# EAGLE design LM3S5749 (EAGLE 6.3)

## Sheet 1 of 2: LM3S5749
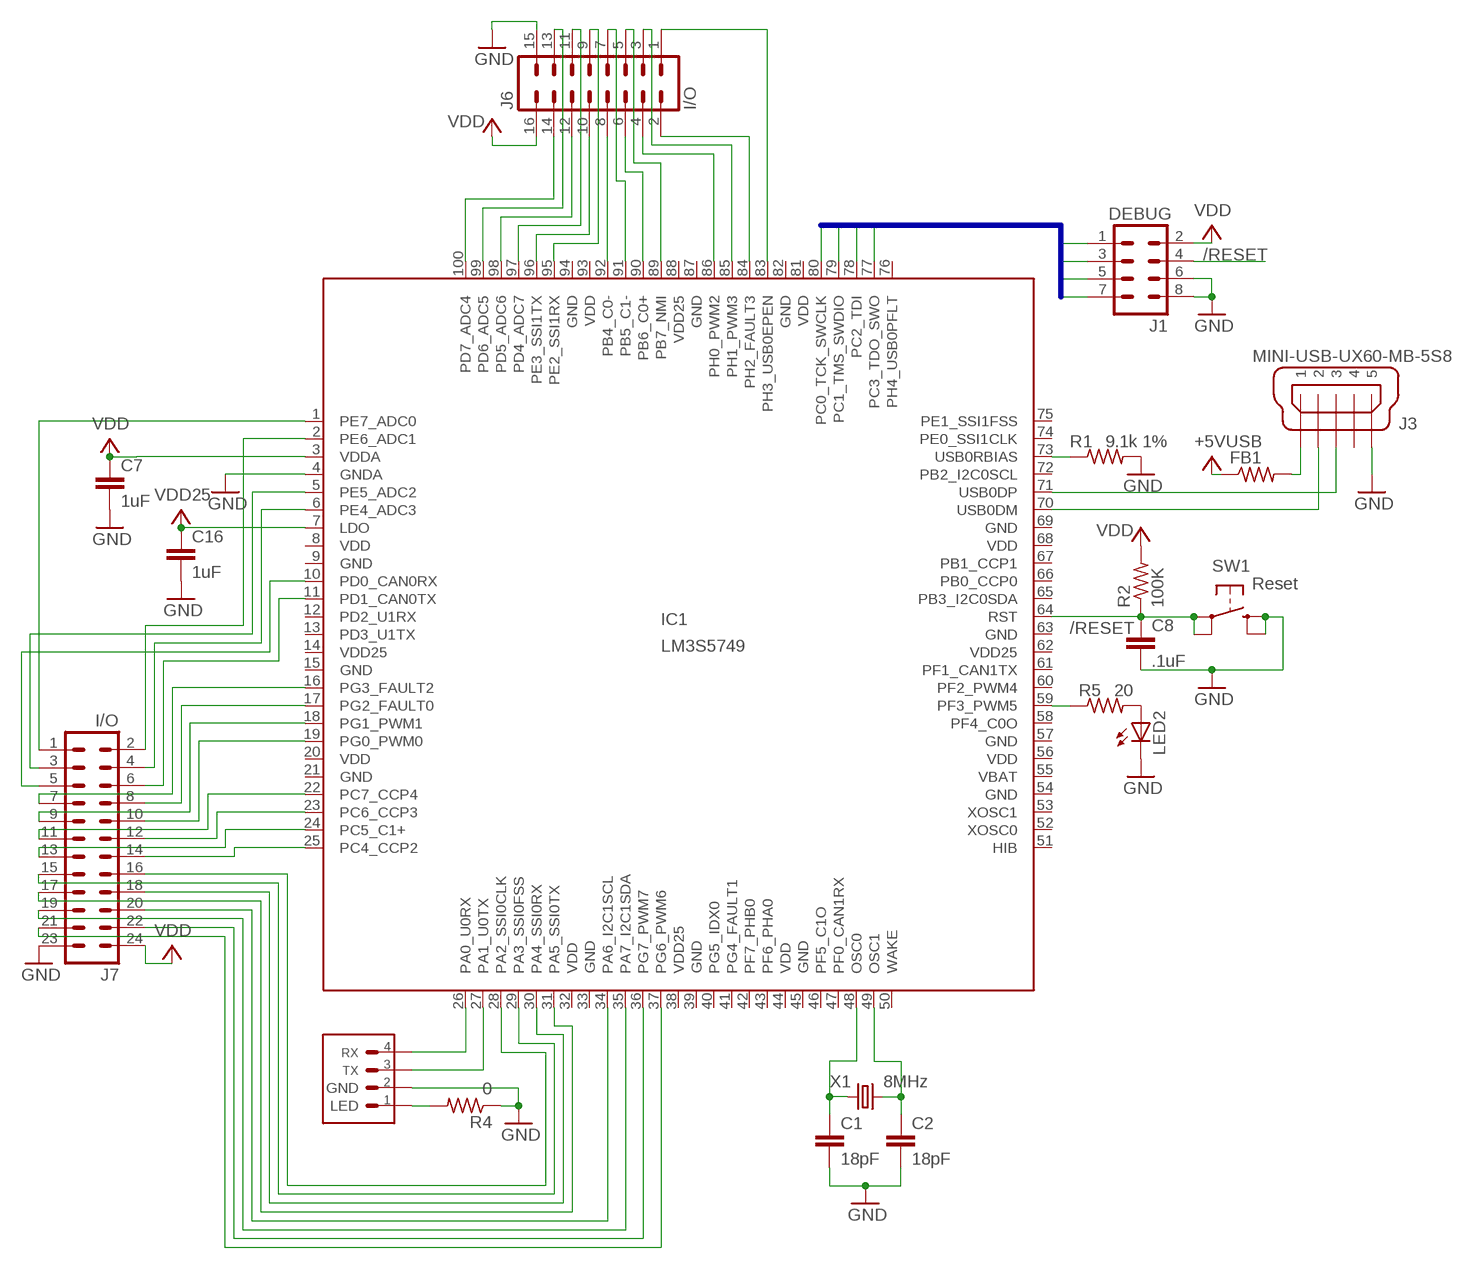
[diagram p0: schematic, sheet 1]

### Parts
C1  18pF  C-EUC0603  [C0603]
C2  18pF  C-EUC0603  [C0603]
C7  1uF  C-EUC0603  [C0603]
C8  .1uF  C-EUC0603  [C0603]
C16  1uF  C-EUC0603  [C0603]
FB1  0  R-US_R0805  [R0805]
IC1  LM3S5749  [LQFP-100]
J1  DEBUG  HEADER_4X2  [HEADER_.100IN_8PIN_4X2]
J3  MINI-USB-UX60-MB-5S8  [UX60-MB-5S8]
J4  Serial  FLEX_SERIAL_HEADER  [4-PIN_1.25MM]
J6  I/O  HEADER_8X2  [HEADER_.100IN_16PIN_8X2]
J7  I/O  HEADER_24PIN_D  [HEADER_.100IN_24PIN_D]
LED2  LEDCHIPLED_0603  [CHIPLED_0603]
R1  9.1k 1%  R-US_R0603  [R0603]
R2  100K  R-US_R0603  [R0603]
R4  0  R-US_R0603  [R0603]
R5  20  R-US_R0603  [R0603]
SW1  Reset  SMT_PUSHBUTTON  [SMT_PUSHBUTTON]
X1  8MHz  XTAL_2SMD_8MMX4.5MM  [2-SMD_8MMX4.5MM]

### Nets
/RESET: C8.1 IC1.64(RST) J1.4 R2.1 SW1.P$1(P1) SW1.P$2(P)
GND: C1.2 C2.2 C7.2 C8.2 C16.2 IC1.4(GNDA) J1.6 J1.8 J3.5 J4.2(S2) J6.15 J7.23 LED2.C R1.2 R4.1 SW1.P$3(S1) SW1.P$4(S) ; also sheet 2
N$1: IC1.73(USB0RBIAS) R1.1
N$2: C1.1 IC1.48(OSC0) X1.1
N$3: C2.1 IC1.49(OSC1) X1.2
N$5: IC1.26(PA0_U0RX) J4.4(S4)
N$6: IC1.27(PA1_U0TX) J4.3(S3)
N$7: FB1.2 J3.1
N$8: FB1.1 ; supply symbol labelled +5VUSB ; also sheet 2
N$9: IC1.16(PG3_FAULT2) J7.7
N$10: IC1.17(PG2_FAULT0) J7.8
N$11: IC1.18(PG1_PWM1) J7.9
N$12: IC1.19(PG0_PWM0) J7.10
N$13: IC1.36(PG7_PWM7) J7.22
N$14: IC1.37(PG6_PWM6) J7.21
N$15: LED2.A R5.2
N$16: IC1.59(PF3_PWM5) R5.1
N$17: IC1.71(USB0DP) J3.3
N$18: IC1.70(USB0DM) J3.2
N$19: IC1.28(PA2_SSI0CLK) J7.16
N$20: IC1.29(PA3_SSI0FSS) J7.15
N$21: IC1.30(PA4_SSI0RX) J7.18
N$22: IC1.31(PA5_SSI0TX) J7.17
N$23: IC1.34(PA6_I2C1SCL) J7.20
N$24: IC1.35(PA7_I2C1SDA) J7.19
N$25: J4.1(S1) R4.2
N$26: IC1.22(PC7_CCP4) J7.11
N$27: IC1.23(PC6_CCP3) J7.12
N$28: IC1.24(PC5_C1+) J7.13
N$29: IC1.25(PC4_CCP2) J7.14
N$30: IC1.83(PH3_USB0EPEN) J6.1
N$31: IC1.84(PH2_FAULT3) J6.2
N$32: IC1.85(PH1_PWM3) J6.3
N$33: IC1.86(PH0_PWM2) J6.4
N$34: IC1.89(PB7_NMI) J6.5
N$35: IC1.90(PB6_C0+) J6.6
N$36: IC1.91(PB5_C1-) J6.7
N$37: IC1.92(PB4_C0-) J6.8
N$38: IC1.95(PE2_SSI1RX) J6.9
N$39: IC1.96(PE3_SSI1TX) J6.10
N$40: IC1.97(PD4_ADC7) J6.11
N$41: IC1.98(PD5_ADC6) J6.12
N$42: IC1.99(PD6_ADC5) J6.13
N$43: IC1.100(PD7_ADC4) J6.14
N$44: IC1.1(PE7_ADC0) J7.1
N$45: IC1.2(PE6_ADC1) J7.2
N$46: IC1.5(PE5_ADC2) J7.3
N$47: IC1.6(PE4_ADC3) J7.4
N$48: IC1.10(PD0_CAN0RX) J7.5
N$49: IC1.11(PD1_CAN0TX) J7.6
TCK: IC1.80(PC0_TCK_SWCLK) J1.1
TDI: IC1.78(PC2_TDI) J1.5
TDO: IC1.77(PC3_TDO_SWO) J1.7
TMS: IC1.79(PC1_TMS_SWDIO) J1.3
VDD: C7.1 IC1.3(VDDA) J1.2 J6.16 J7.24 R2.2 ; also sheet 2
VDD25: C16.1 IC1.7(LDO) ; also sheet 2
Unconnected: IC1.12(PD2_U1RX) IC1.13(PD3_U1TX) IC1.40(PG5_IDX0) IC1.41(PG4_FAULT1) IC1.42(PF7_PHB0) IC1.43(PF6_PHA0) IC1.46(PF5_C1O) IC1.47(PF0_CAN1RX) IC1.50(WAKE) IC1.51(HIB) IC1.52(XOSC0) IC1.53(XOSC1) IC1.55(VBAT) IC1.58(PF4_C0O) IC1.60(PF2_PWM4) IC1.61(PF1_CAN1TX) IC1.65(PB3_I2C0SDA) IC1.66(PB0_CCP0) IC1.67(PB1_CCP1) IC1.72(PB2_I2C0SCL) IC1.74(PE0_SSI1CLK) IC1.75(PE1_SSI1FSS) IC1.76(PH4_USB0PFLT) J3.4

### Buses
TCK,TMS,TDI,TDO

## Sheet 2 of 2: Power
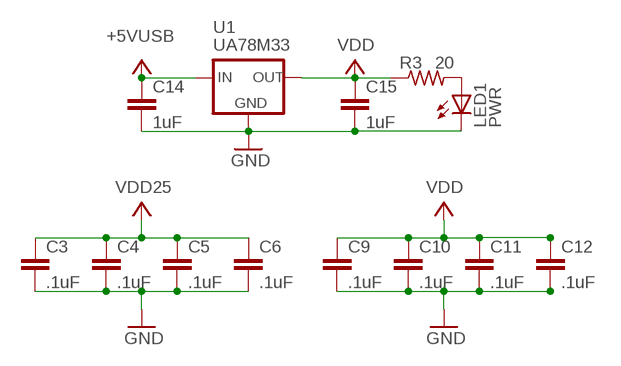
[diagram p1: schematic, sheet 2]

### Parts
C3  .1uF  C-EUC0603  [C0603]
C4  .1uF  C-EUC0603  [C0603]
C5  .1uF  C-EUC0603  [C0603]
C6  .1uF  C-EUC0603  [C0603]
C9  .1uF  C-EUC0603  [C0603]
C10  .1uF  C-EUC0603  [C0603]
C11  .1uF  C-EUC0603  [C0603]
C12  .1uF  C-EUC0603  [C0603]
C14  1uF  C-EUC0603  [C0603]
C15  1uF  C-EUC0603  [C0603]
LED1  PWR  LEDCHIPLED_0603  [CHIPLED_0603]
R3  20  R-US_R0603  [R0603]
U1  UA78M33  [SOT-223]

### Nets
GND: C3.2 C4.2 C5.2 C6.2 C9.2 C10.2 C11.2 C12.2 C14.2 C15.2 LED1.C U1.2(GND) U1.4(GND) ; also sheet 1
N$4: LED1.A R3.2
N$8: C14.1 U1.1(IN) ; supply symbol labelled +5VUSB ; also sheet 1
VDD: C9.1 C10.1 C11.1 C12.1 C15.1 R3.1 U1.3(OUT) ; also sheet 1
VDD25: C3.1 C4.1 C5.1 C6.1 ; also sheet 1

## Power pins joined to a net without a drawn wire
GND: IC1.9(GND) IC1.15(GND) IC1.21(GND) IC1.33(GND) IC1.39(GND) IC1.45(GND) IC1.54(GND) IC1.57(GND) IC1.63(GND) IC1.69(GND) IC1.82(GND) IC1.87(GND) IC1.94(GND)
VDD: IC1.8(VDD) IC1.20(VDD) IC1.32(VDD) IC1.44(VDD) IC1.56(VDD) IC1.68(VDD) IC1.81(VDD) IC1.93(VDD)
VDD25: IC1.14(VDD25) IC1.38(VDD25) IC1.62(VDD25) IC1.88(VDD25)

## Library data of the parts
C1-C12 C14-C16 = rcl:C-EU: CAPACITOR, European symbol
FB1 R1-R5 = rcl:R-US_: RESISTOR, American symbol
IC1 = Custom:LM3S5749: SPMM147_lm3s5749_ra0_lqfp_v1p0 edit this description Auto generated by make-symbol-device-package-bsdl_edited.ulp Rev. 42 Source: SPMM147_lm3s5749_ra0_lqfp_v1p0.bsdl
J1 = Custom:HEADER_4X2
J3 = con-hirose:MINI-USB-: MINI USB Connector Source: http://www.hirose.co.jp/cataloge_hp/e24000019.pdf; OC_FARNELL: unknown; OC_NEWARK: unknown
J4 = Custom:FLEX_SERIAL_HEADER
J6 = Custom:HEADER_8X2
J7 = Custom:HEADER_24PIN_D
LED1 LED2 = led:LED: LED OSRAM: - CHIPLED LG R971, LG N971, LY N971, LG Q971, LY Q971, LO R971, LY R971 LH N974, LH R974 LS Q976, LO Q976, LY Q976 LO Q996 - Hyper CHIPLED LW Q18S LB Q993, LB Q99A, LB R99A - SideLED LS A670, LO A670, LY A670, LG A670, LP A670 LB A673, LV A673, LT A673, LW A673 LH A674 LY A675 LS A676, LA A676, LO A676, LY A676, LW A676 LS A679, LY A679, LG A679 - Hyper Micro SIDELED® LS Y876, LA Y876, LO Y876, LY Y876 LT Y87S - SmartLED LW L88C, LW L88S LB L89C, LB L89S, LG L890 LS L89K, LO L89K, LY L89K LS L896, LA L896, LO L896, LY L896 - TOPLED LS T670, LO T670, LY T670, LG T670, LP T670 LSG T670, LSP T670, LSY T670, LOP T670, LYG T670 LG T671, LOG T671, LSG T671 LB T673, LV T673, LT T673, LW T673 LH T674 LS T676, LA T676, LO T676, LY T676, LB T676, LH T676, LSB T676, LW T676 LB T67C, LV T67C, LT T67C, LS T67K, LO T67K, LY T67K, LW E67C LS E67B, LA E67B, LO E67B, LY E67B, LB E67C, LV E67C, LT E67C LW T67C LS T679, LY T679, LG T679 LS T770, LO T770, LY T770, LG T770, LP T770 LB T773, LV T773, LT T773, LW T773 LH T774 LS E675, LA E675, LY E675, LS T675 LS T776, LA T776, LO T776, LY T776, LB T776 LHGB T686 LT T68C, LB T68C - Hyper Mini TOPLED® LB M676 - Mini TOPLED Santana® LG M470 LS M47K, LO M47K, LY M47K Source: http://www.osram.convergy.de LUXEON: - LUMILED® LXK2-PW12-R00, LXK2-PW12-S00, LXK2-PW14-U00, LXK2-PW14-V00 LXK2-PM12-R00, LXK2-PM12-S00, LXK2-PM14-U00 LXK2-PE12-Q00, LXK2-PE12-R00, LXK2-PE12-S00, LXK2-PE14-T00, LXK2-PE14-U00 LXK2-PB12-K00, LXK2-PB12-L00, LXK2-PB12-M00, LXK2-PB14-N00, LXK2-PB14-P00, LXK2-PB14-Q00 LXK2-PR12-L00, LXK2-PR12-M00, LXK2-PR14-Q00, LXK2-PR14-R00 LXK2-PD12-Q00, LXK2-PD12-R00, LXK2-PD12-S00 LXK2-PH12-R00, LXK2-PH12-S00 LXK2-PL12-P00, LXK2-PL12-Q00, LXK2-PL12-R00 Source: www.luxeon.com KINGBRIGHT: KA-3528ASYC Source: www.kingbright.com
SW1 = Custom:SMT_PUSHBUTTON: SMT Pushbutton 5.2 x 5.2 mm
U1 = Custom:UA78M33: uA78M33 - Positive Voltage Regulator 3.3V 500mA Fixed Positive-Voltage Regulator Datasheet: http://www.ti.com/lit/ds/symlink/ua78m33.pdf; DIGIKEY: 296-13424-1-ND
X1 = Custom:XTAL_2SMD_8MMX4.5MM: SMD Crystal 2-SMD 8.0 x 4.5 x 1.4mm Crystal Taken from: http://www.abracon.com/Resonators/abm2.pdf; DIGIKEY: 535-10870-1-ND

## Board
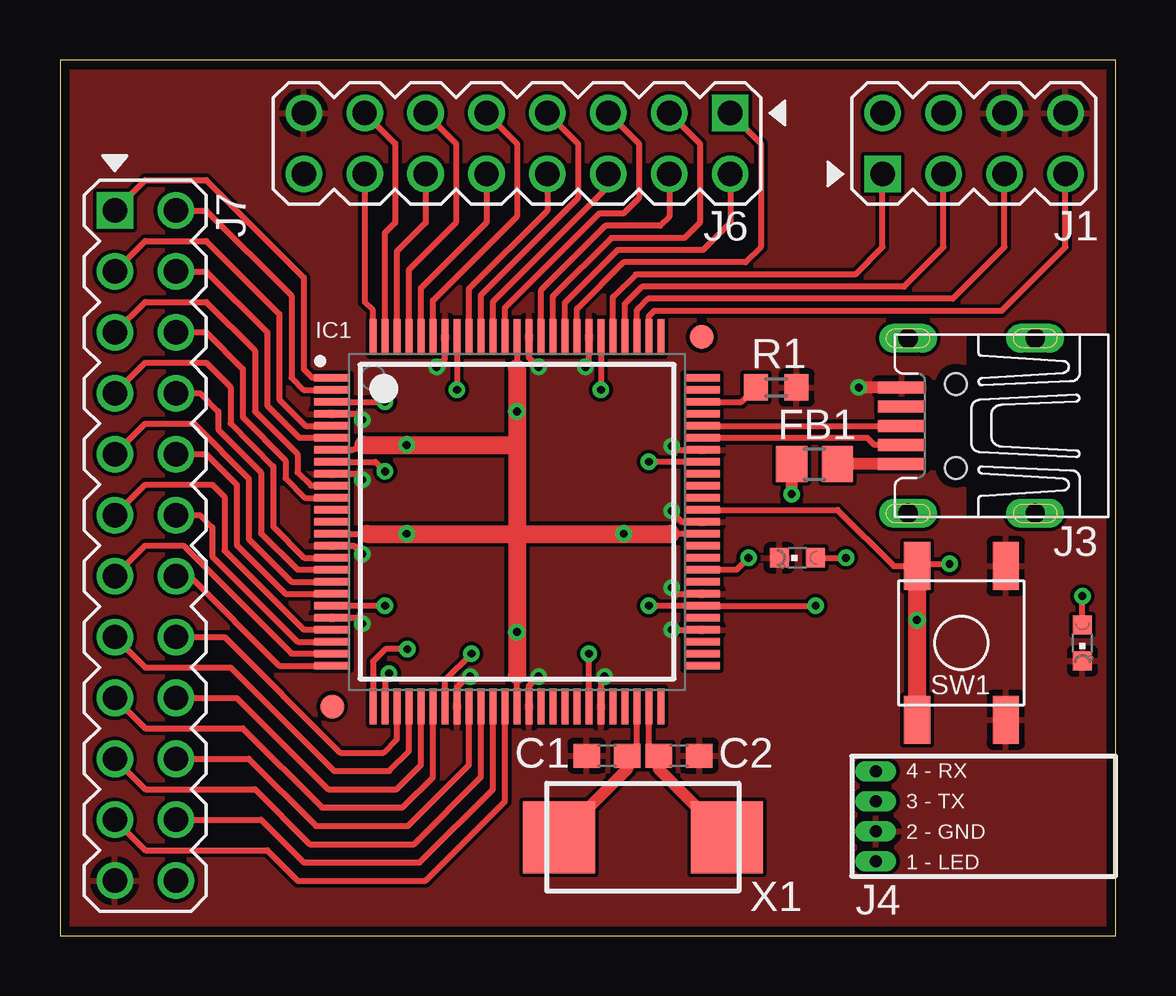
[diagram p2: board, top side]
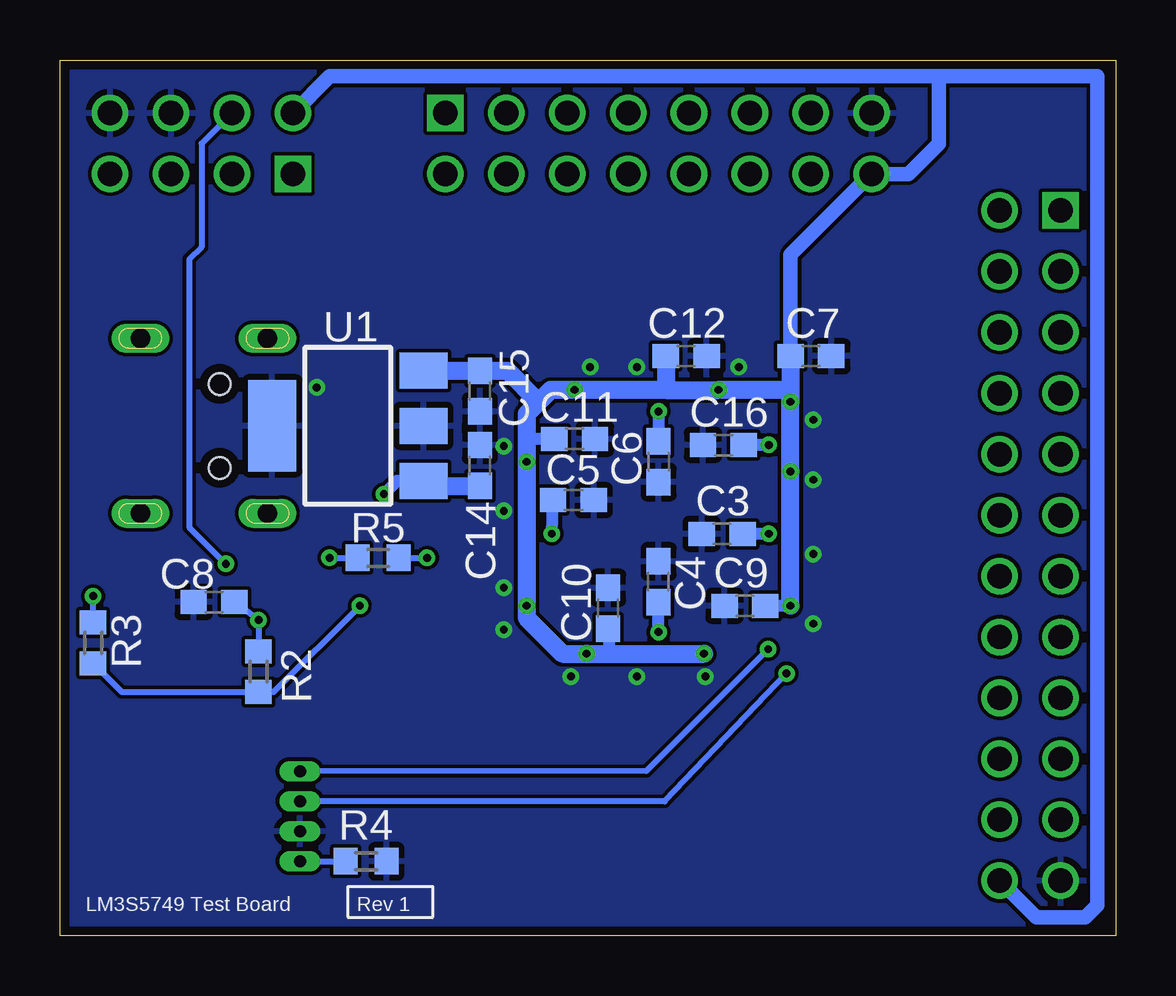
[diagram p3: board, bottom side, seen from below]

Size 44 x 36.5 mm. Coordinates in mm from the lower left corner, seen from the top.
Outline: 0,0 44,0 44,36.5 0,36.5 0,0
Copper layers (1*16): Top 0.0356mm / dielectric 1.5011mm / Bottom 0.0356mm
Design rules: minimum track width 6mil, minimum drill 13mil, track to track 6mil, track to pad 6mil, pad to pad 6mil, via to via 6mil, smd to smd 6mil, copper to edge 15mil, drill to drill 6mil, minimum pad ring 7mil, minimum via ring 7mil, stop-mask expansion 4mil, vias tented up to drill 15mil, thermal gap 10mil

### Footprints (pad centres in the part's own frame; a part is rotated, then mirrored left to right if it is on the bottom)
C0603 = smd 1.1 x 1: 1 -0.85,0; 2 0.85,0
R0805 = smd 1.3 x 1.5: 1 -0.95,0; 2 0.95,0
LQFP-100 = smd 1.5 x 0.3: 1 -7.7,6; 2 -7.7,5.5; 3 -7.7,5; 4 -7.7,4.5; 5 -7.7,4; 6 -7.7,3.5; 7 -7.7,3; 8 -7.7,2.5; 9 -7.7,2; 10 -7.7,1.5; 11 -7.7,1; 12 -7.7,0.5; 13 -7.7,0; 14 -7.7,-0.5; 15 -7.7,-1; 16 -7.7,-1.5; 17 -7.7,-2; 18 -7.7,-2.5; 19 -7.7,-3; 20 -7.7,-3.5; 21 -7.7,-4; 22 -7.7,-4.5; 23 -7.7,-5; 24 -7.7,-5.5; 25 -7.7,-6; 51 7.7,-6; 52 7.7,-5.5; 53 7.7,-5; 54 7.7,-4.5; 55 7.7,-4; 56 7.7,-3.5; 57 7.7,-3; 58 7.7,-2.5; 59 7.7,-2; 60 7.7,-1.5; 61 7.7,-1; 62 7.7,-0.5; 63 7.7,0; 64 7.7,0.5; 65 7.7,1; 66 7.7,1.5; 67 7.7,2; 68 7.7,2.5; 69 7.7,3; 70 7.7,3.5; 71 7.7,4; 72 7.7,4.5; 73 7.7,5; 74 7.7,5.5; 75 7.7,6 | smd 0.3 x 1.5: 26 -6,-7.7; 27 -5.5,-7.7; 28 -5,-7.7; 29 -4.5,-7.7; 30 -4,-7.7; 31 -3.5,-7.7; 32 -3,-7.7; 33 -2.5,-7.7; 34 -2,-7.7; 35 -1.5,-7.7; 36 -1,-7.7; 37 -0.5,-7.7; 38 0,-7.7; 39 0.5,-7.7; 40 1,-7.7; 41 1.5,-7.7; 42 2,-7.7; 43 2.5,-7.7; 44 3,-7.7; 45 3.5,-7.7; 46 4,-7.7; 47 4.5,-7.7; 48 5,-7.7; 49 5.5,-7.7; 50 6,-7.7; 76 6,7.7; 77 5.5,7.7; 78 5,7.7; 79 4.5,7.7; 80 4,7.7; 81 3.5,7.7; 82 3,7.7; 83 2.5,7.7; 84 2,7.7; 85 1.5,7.7; 86 1,7.7; 87 0.5,7.7; 88 0,7.7; 89 -0.5,7.7; 90 -1,7.7; 91 -1.5,7.7; 92 -2,7.7; 93 -2.5,7.7; 94 -3,7.7; 95 -3.5,7.7; 96 -4,7.7; 97 -4.5,7.7; 98 -5,7.7; 99 -5.5,7.7; 100 -6,7.7 | smd 1 x 1: 101 -7.7,-7.7; 102 7.7,7.7
HEADER_.100IN_8PIN_4X2 = drill 1.016 square: 1 -3.81,-1.27 | drill 1.016: 2 -3.81,1.27; 3 -1.27,-1.27; 4 -1.27,1.27; 5 1.27,-1.27; 6 1.27,1.27; 7 3.81,-1.27; 8 3.81,1.27
UX60-MB-5S8 = smd 2 x 0.5: 1 8.65,1.6; 2 8.65,0.8; 3 8.65,0; 4 8.65,-0.8; 5 8.65,-1.6 | drill 0.8 long: M1 3.1,-3.65; M2 3.1,3.65; M3 8.4,3.65; M4 8.4,-3.65 | hole 0.9: 6.4,-1.75; 6.4,1.75
4-PIN_1.25MM = drill 0.5 pad 0.698 long: 1 1.875,0; 2 0.625,0; 3 -0.625,0; 4 -1.875,0
HEADER_.100IN_16PIN_8X2 = drill 1.016 square: 1 -8.89,-1.27 | drill 1.016: 2 -8.89,1.27; 3 -6.35,-1.27; 4 -6.35,1.27; 5 -3.81,-1.27; 6 -3.81,1.27; 7 -1.27,-1.27; 8 -1.27,1.27; 9 1.27,-1.27; 10 1.27,1.27; 11 3.81,-1.27; 12 3.81,1.27; 13 6.35,-1.27; 14 6.35,1.27; 15 8.89,-1.27; 16 8.89,1.27
HEADER_.100IN_24PIN_D = drill 1.016 square: 1 -13.97,-1.27 | drill 1.016: 2 -13.97,1.27; 3 -11.43,-1.27; 4 -11.43,1.27; 5 -8.89,-1.27; 6 -8.89,1.27; 7 -6.35,-1.27; 8 -6.35,1.27; 9 -3.81,-1.27; 10 -3.81,1.27; 11 -1.27,-1.27; 12 -1.27,1.27; 13 1.27,-1.27; 14 1.27,1.27; 15 3.81,-1.27; 16 3.81,1.27; 17 6.35,-1.27; 18 6.35,1.27; 19 8.89,-1.27; 20 8.89,1.27; 21 11.43,-1.27; 22 11.43,1.27; 23 13.97,-1.27; 24 13.97,1.27
CHIPLED_0603 = smd 0.8 x 0.8: A 0,-0.75; C 0,0.75
R0603 = smd 1 x 1.1: 1 -0.85,0; 2 0.85,0
SMT_PUSHBUTTON = smd 2 x 1.1: P$1 -3.2,1.85; P$2 3.2,1.85; P$3 -3.2,-1.85; P$4 3.2,-1.85
SOT-223 = smd 1.5 x 2: 1 -2.3,-3.15; 2 0,-3.15; 3 2.3,-3.15 | smd 3.8 x 2: 4 0,3.15
2-SMD_8MMX4.5MM = smd 3 x 3: 1 -3.5,0; 2 3.5,0

### Placement (x,y rotation side)
C1  22.8,7.5 180 top
C2  25.8,7.5 0 top
C3  16.4,16.75 180 bottom
C4  19.05,14.75 90 bottom
C5  22.6,18.15 0 bottom
C6  19.05,19.75 270 bottom
C7  12.7,24.15 0 bottom
C8  37.58,13.9 180 bottom
C9  15.45,13.75 180 bottom
C10  21.15,13.65 90 bottom
C11  22.55,20.7 0 bottom
C12  17.9,24.15 0 bottom
C14  26.5,19.6 90 bottom
C15  26.5,22.7 270 bottom
C16  16.35,20.45 180 bottom
FB1  31.45,19.65 0 top
IC1  19.05,17.25 0 top
J1  38.1,33.02 0 top
J3  43.75,21.25 180 top
J4  34,4.97 270 top
J6  19.05,33.02 180 top
J7  3.56,16.26 270 top
LED1  42.62,12.2 180 top
LED2  30.73,15.75 90 top
R1  29.85,22.85 0 top
R2  35.73,11 270 bottom
R3  42.62,12.2 90 bottom
R4  31.24,3.1 180 bottom
R5  30.73,15.75 180 bottom
SW1  37.58,12.2 90 top
U1  32,21.25 90 bottom
X1  24.3,4.1 0 top

### Tracks (layer width: path | path; a pad name or v marks a point on that pad's centre or on a via)
/RESET  (via drill 0.33 pad 0.51)
  Top 0.25: IC1.64 32.41,17.75 34.76,15.4 SW1.P$2 35.81,15.49 v37.08,15.49
  Top 0.75: SW1.P$1 v35.73,13.15 SW1.P$2
  Bottom 0.25: C8.1 v35.73,13.15 R2.1 | v37.08,15.49 38.61,17.02 38.61,28.19 38.1,28.7 38.1,33.02 J1.4
GND  (via drill 0.33 pad 0.51)
  Top 0.25: v12.6,19 12.35,19.25 IC1.9 | v12.6,21.5 12.35,21.75 IC1.4 | v12.6,13 12.35,13.25 IC1.21 | v12.6,15.9 12.25,16.25 IC1.15 | v17.1,10.8 17,10.8 16.55,10.35 IC1.33 | v19.95,10.8 19.55,10.4 IC1.39 | v22.7,10.8 22.55,10.65 IC1.45 | v25.5,12.75 IC1.54 | v25.5,14.5 25.75,14.25 IC1.57 | v25.5,17.7 25.95,17.25 IC1.63 | v25.5,20.4 25.65,20.25 IC1.69 | v21.9,23.7 22.05,23.85 IC1.82 | v19.95,23.7 19.55,24.1 IC1.87 | v15.7,23.7 16.05,24.05 IC1.94
  Top 0.5: J3.5 v33.3,22.85
  pour Bottom: 0,36.5 44,36.5 44,0 0,0
  pour Top: 0,36.5 44,36.5 44,0 0,0
N$1
  Top 0.25: IC1.73 28.4,22.25 R1.1
N$2
  Top 0.25: C1.1 24.05,7.9 IC1.48
  Top 0.5: C1.1 23.65,6.95 X1.1
N$3
  Top 0.25: C2.1 24.55,7.9 IC1.49
  Top 0.5: C2.1 24.95,6.95 X1.2
N$4  (via drill 0.33 pad 0.51)
  Top 0.25: LED1.A v42.62,14.15
  Bottom 0.25: R3.2 v42.62,14.15
N$5  (via drill 0.33 pad 0.51)
  Top 0.25: v14.48,11.94 13.56,11.94 13.05,11.43 IC1.26 | IC1.26
  Bottom 0.25: v14.48,11.94 19.56,6.86 J4.4
N$6  (via drill 0.33 pad 0.51)
  Top 0.25: v13.72,10.92 13.55,10.76 IC1.27
  Bottom 0.25: v13.72,10.92 18.8,5.59 J4.3
N$7
  Top 0.5: J3.1 FB1.2
N$8  (via drill 0.33 pad 0.51)
  Top 0.5: v30.5,18.4 FB1.1
  Bottom 0.5: U1.1 29.95,18.95 v30.5,18.4
  Bottom 0.75: U1.1 28.65,18.75 C14.1
N$9
  Top 0.25: J7.7 3.56,23.88 6.1,23.88 7.11,22.86 7.11,21.36 8.89,19.56 8.89,17.05 10.19,15.75 IC1.16 | IC1.16
N$10
  Top 0.25: J7.8 5.84,22.61 6.6,21.84 6.6,21.1 8.38,19.3 8.38,16.76 9.91,15.25 IC1.17
N$11
  Top 0.25: J7.9 3.56,21.34 5.59,21.34 7.87,19.05 7.87,16.53 9.65,14.75 IC1.18 | IC1.18
N$12
  Top 0.25: J7.10 6.1,20.07 7.37,18.8 7.37,16.28 9.4,14.25 IC1.19
N$13
  Top 0.25: J7.22 8.38,4.83 10.16,3.05 15,3.05 18.05,6.1 IC1.36
N$14
  Top 0.25: J7.21 3.56,3.56 8.64,3.56 9.91,2.29 15.25,2.29 18.55,5.59 IC1.37
N$15  (via drill 0.33 pad 0.51)
  Top 0.25: LED2.A v32.77,15.75
  Bottom 0.25: v32.77,15.75 R5.2
N$16  (via drill 0.33 pad 0.51)
  Top 0.25: IC1.59 28.2,15.25 v28.7,15.75
  Bottom 0.25: R5.1 v28.7,15.75
N$17
  Top 0.25: IC1.71 J3.3
N$18
  Top 0.25: J3.2 33.95,20.45 33.65,20.75 IC1.70
N$19
  Top 0.25: J7.16 6.86,12.45 11.68,7.62 13.48,7.62 14.05,8.19 IC1.28
N$20
  Top 0.25: J7.15 3.56,11.18 7.11,11.18 11.43,6.86 13.73,6.86 14.55,7.68 IC1.29 | IC1.29
N$21
  Top 0.25: J7.18 7.37,9.91 11.18,6.1 14.03,6.1 15.05,7.11 IC1.30
N$22
  Top 0.25: J7.17 3.56,8.64 7.62,8.64 10.92,5.33 14.28,5.33 15.55,6.6 IC1.31
N$23
  Top 0.25: J7.20 7.87,7.37 10.67,4.57 14.51,4.57 17.05,7.11 IC1.34
N$24
  Top 0.25: J7.19 3.56,6.1 8.13,6.1 10.41,3.81 14.76,3.81 17.55,6.61 IC1.35
N$25
  Bottom 0.25: J4.1 R4.2
N$26
  Top 0.25: J7.11 3.56,18.8 6.35,18.8 6.86,18.29 6.86,16.05 10.16,12.75 IC1.22 | IC1.22
N$27
  Top 0.25: J7.12 5.84,17.53 6.35,17.02 6.35,15.81 9.91,12.25 IC1.23
N$28
  Top 0.25: J7.13 3.56,16.26 5.15,16.26 9.65,11.75 IC1.24
N$29
  Top 0.25: J7.14 5.41,14.99 9.14,11.25 IC1.25
N$30
  Top 0.25: J6.1 29.21,33.02 29.21,28.7 28.57,28.07 23.5,28.07 21.59,26.16 21.55,26.12 IC1.83
N$31
  Top 0.25: J6.2 27.94,29.72 26.8,28.57 23.24,28.57 21.08,26.42 21.05,26.38 IC1.84
N$32
  Top 0.25: J6.3 26.67,33.02 26.67,29.72 26.04,29.08 22.99,29.08 20.57,26.67 20.55,26.64 IC1.85
N$33
  Top 0.25: J6.4 25.4,29.97 25.02,29.59 22.73,29.59 20.07,26.92 20.05,26.91 IC1.86
N$34
  Top 0.25: J6.5 24.13,33.02 24.13,30.73 23.5,30.1 22.48,30.1 18.55,26.17 IC1.89
N$35
  Top 0.25: J6.6 22.86,31.24 18.05,26.44 18.05,26.43 IC1.90
N$36
  Top 0.25: J6.7 21.59,33.02 21.59,30.73 17.55,26.7 17.55,26.69 IC1.91
N$37
  Top 0.25: J6.8 20.32,30.23 17.05,26.96 IC1.92
N$38
  Top 0.25: J6.9 19.05,33.02 19.05,29.97 15.55,26.47 | IC1.95 15.55,26.47 | 15.55,26.47
N$39
  Top 0.25: J6.10 17.78,29.72 15.05,26.99 | IC1.96 15.05,26.99 | 15.05,26.99
N$40
  Top 0.25: J6.11 16.51,33.02 16.51,29.72 14.55,27.76 IC1.97
N$41
  Top 0.25: J6.12 15.24,29.72 14.05,28.53 IC1.98
N$42
  Top 0.25: J6.13 13.97,33.02 13.97,29.72 13.55,29.3 IC1.99
N$43
  Top 0.25: J6.14 12.7,26.42 13.05,26.07 IC1.100
N$44
  Top 0.25: J7.1 3.56,31.5 6.1,31.5 10.16,27.43 10.16,23.61 10.52,23.25 IC1.1 | IC1.1
N$45
  Top 0.25: J7.2 6.1,30.23 9.65,26.67 9.65,23.26 10.16,22.75 IC1.2 | IC1.2
N$46
  Top 0.25: J7.3 3.56,28.96 6.1,28.96 9.14,25.91 9.14,22.35 10.25,21.25 IC1.5
N$47
  Top 0.25: J7.4 6.1,27.69 8.64,25.15 8.64,22.08 9.97,20.75 IC1.6
N$48
  Top 0.25: J7.5 3.56,26.42 6.1,26.42 8.13,24.38 8.13,21.84 9.91,20.07 9.91,19.3 10.46,18.75 IC1.10 | IC1.10
N$49
  Top 0.25: J7.6 6.1,25.15 7.62,23.62 7.62,21.61 9.4,19.81 9.4,19.07 10.22,18.25 IC1.11
TCK
  Top 0.25: IC1.80 23.05,26.6 23.11,26.67 24,27.56 33.15,27.56 34.29,28.7 J1.1
TDI
  Top 0.25: IC1.78 24.05,26.08 24.13,26.16 24.51,26.54 37.21,26.54 39.37,28.7 J1.5
TDO
  Top 0.25: IC1.77 24.55,25.82 24.77,26.04 39.24,26.04 41.91,28.7 J1.7
TMS
  Top 0.25: IC1.79 23.56,26.36 23.62,26.42 24.26,27.05 35.18,27.05 36.83,28.7 J1.3
VDD  (via drill 0.33 pad 0.51)
  Top 0.25: IC1.8 13.15,19.75 v13.55,19.35 | IC1.3 v13.55,22.25 | v13.55,13.75 IC1.20 | IC1.93 v16.55,22.75 | IC1.81 v22.55,22.75 | IC1.68 v24.55,19.75 | v24.55,13.75 IC1.56 v31.5,13.75 | IC1.44 v22.05,11.75 | IC1.32 16.05,10.65 v17.15,11.75
  Bottom 0.25: v31.5,13.75 35.1,10.15 R2.2 41.42,10.15 R3.1
  Bottom 0.5: v13.55,13.75 C9.1 | C10.1 21.1,11.75 | C11.1 24.55,20.7 v24.55,19.75 | R3.1
  Bottom 0.61: 7.37,35.81 32.77,35.81 J1.2 | 7.37,35.81 7.37,33.02 8.64,31.75 J6.16 10.16,31.77 13.55,28.38 C7.1 | 7.37,35.81 0.76,35.81 0.76,1.27 1.27,0.76 3.3,0.76 J7.24
  Bottom 0.75: v13.55,13.75 v13.55,19.35 v13.55,22.25 | v13.55,22.25 13.55,22.75 v16.55,22.75 18.75,22.75 | 18.75,22.75 v22.55,22.75 23.55,22.75 24.05,22.25 | 24.05,22.25 24.55,21.75 v24.55,19.75 v24.55,13.75 24.55,13.25 23.05,11.75 v22.05,11.75 21.1,11.75 v17.15,11.75 | C7.1 v13.55,22.25 | C12.1 18.75,22.75 | U1.3 C15.1 25.35,23.55 24.05,22.25
VDD25  (via drill 0.33 pad 0.51)
  Top 0.25: IC1.7 12.15,20.25 12.65,20.45 | IC1.14 12.8,16.75 | IC1.38 19.05,10.85 | IC1.62 25.45,16.75 | IC1.88 19.05,23.65
  Top 0.75: 12.8,16.75 v14.45,16.75 19.05,16.75 | 19.05,16.75 v19.05,12.65 19.05,10.85 | 19.05,23.65 v19.05,21.85 19.05,20.45 | 12.65,20.45 v14.45,20.45 19.05,20.45 | 19.05,20.45 19.05,16.75 | 19.05,16.75 v23.5,16.75 25.45,16.75
  Bottom 0.5: v14.45,20.45 C16.1 | v14.45,16.75 C3.1 | v19.05,12.65 C4.1 | v23.5,16.75 C5.1 | v19.05,21.85 C6.1

### Text on the board
bNames: Rev 1 | LM3S5749 Test Board
tValues: Ryan Mamone 2012